# Altium schematic sheet LIDO-HW.300.StatusLightInterface.SchDoc
size A3; SheetNumber: 16; SheetTotal: 17
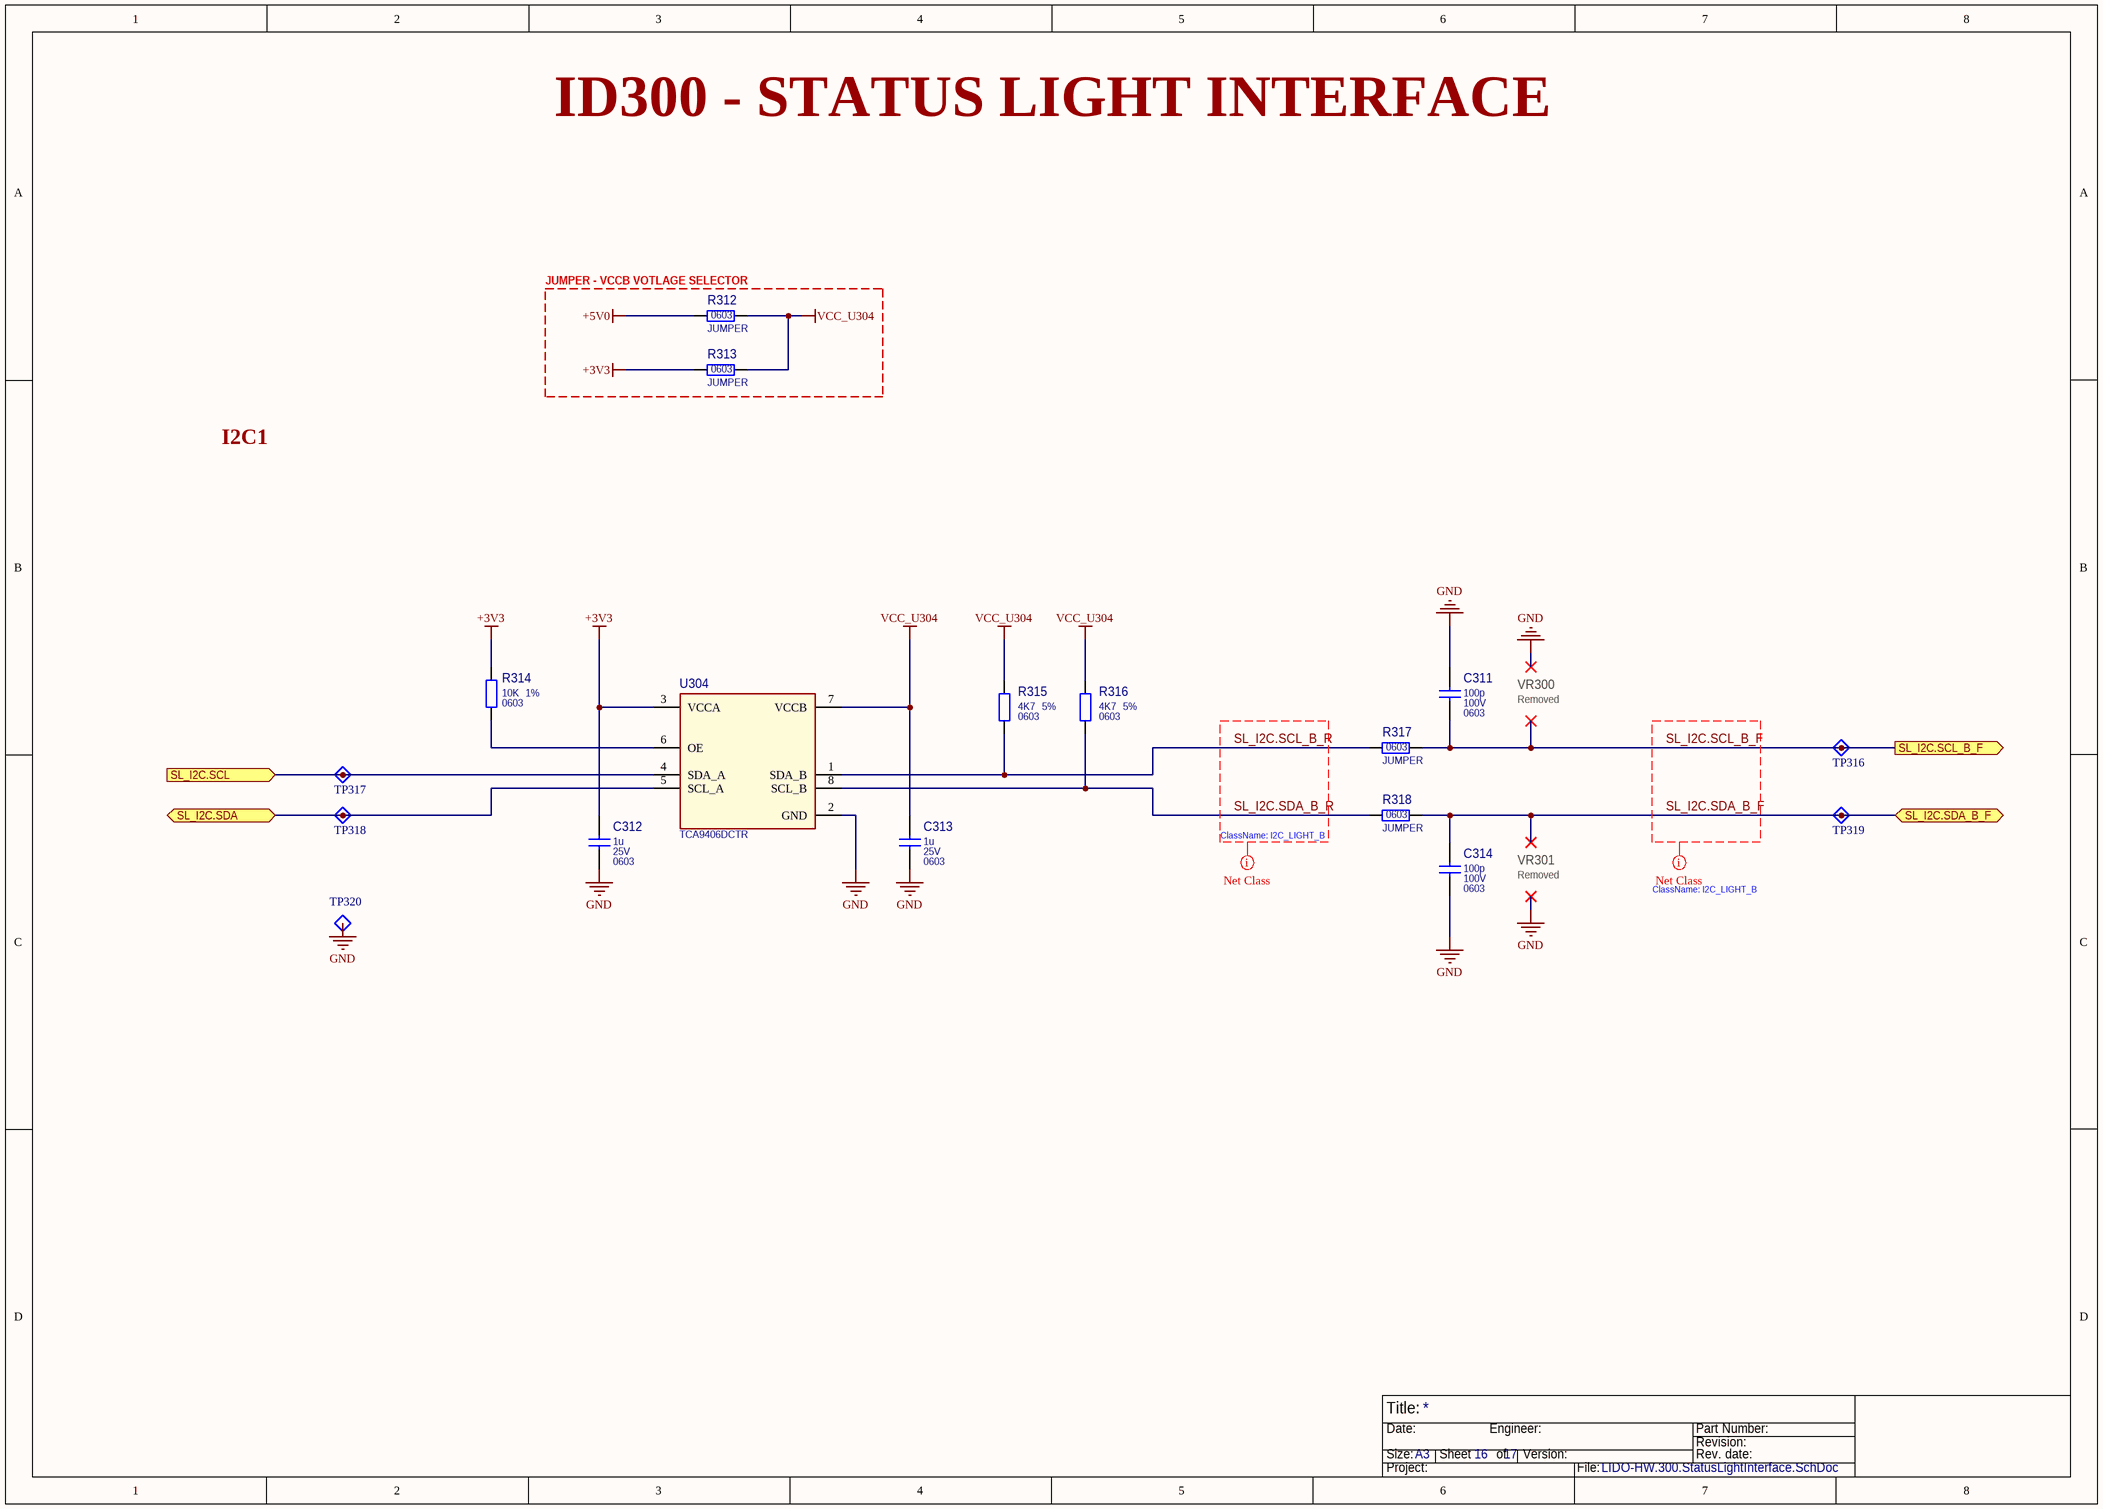
[diagram p0: LIDO-HW.300.StatusLightInterface.SchDoc]

## Parts
C311  100p  Part Value 2: 100V  Part Package: 0603  [CAP_0603_1608X90-N_MURATA_A]
C312  1u  Part Value 2: 25V  Part Package: 0603  [CAP_0603_1608X90-N_MURATA_A]
C313  1u  Part Value 2: 25V  Part Package: 0603  [CAP_0603_1608X90-N_MURATA_A]
C314  100p  Part Value 2: 100V  Part Package: 0603  [CAP_0603_1608X90-N_MURATA_A]
R312  JUMPER  Part Package: 0603  [RES_0603_1608X60-N_YAGEO_A]
R313  JUMPER  Part Package: 0603  [RES_0603_1608X60-N_YAGEO_A]
R314  10K  Part Value 2: 1%  Part Package: 0603  [RES_0603_1608X60-N_YAGEO_A]
R315  4K7  Part Value 2: 5%  Part Package: 0603  [RES_0603_1608X60-N_YAGEO_A]
R316  4K7  Part Value 2: 5%  Part Package: 0603  [RES_0603_1608X60-N_YAGEO_A]
R317  JUMPER  Part Package: 0603  [RES_0603_1608X60-N_YAGEO_A]
R318  JUMPER  Part Package: 0603  [RES_0603_1608X60-N_YAGEO_A]
TP316  TestPoint_A  [TESTPOINT_1D_A]  (value not drawn)  (no BOM)
TP317  TestPoint_A  [TESTPOINT_1D_A]  (value not drawn)  (no BOM)
TP318  TestPoint_A  [TESTPOINT_1D_A]  (value not drawn)  (no BOM)
TP319  TestPoint_A  [TESTPOINT_1D_A]  (value not drawn)  (no BOM)
TP320  TestPoint_A  [TESTPOINT_1D_A]  (value not drawn)  (no BOM)
U304  TCA9406DCTR  [SSOP8P65_295X400X130L40X25-N_TI_A]

## Blocks framed on the sheet
JUMPER - VCCB VOTLAGE SELECTOR: R312 R313

## Ports
SL_I2C.SCL (in), SL_I2C.SCL_B_F (out), SL_I2C.SDA (bidir), SL_I2C.SDA_B_F (bidir)

## Nets
+3V3: C312.1 R313.1 R314.2 U304.3(VCCA)
+5V0: R312.1
GND: C311.1 C312.2 C313.2 C314.2 TP320.1(TP) U304.2(GND)
VCC_U304: C313.1 R312.2 R313.2 R315.2 R316.2 U304.7(VCCB)
SL_I2C.SCL: TP317.1(TP) U304.4(SDA_A) ; port SL_I2C.SCL
SL_I2C.SCL_B_F: C311.2 R317.2 TP316.1(TP) ; port SL_I2C.SCL_B_F
SL_I2C.SCL_B_R: R315.1 R317.1 U304.1(SDA_B)
SL_I2C.SDA: TP318.1(TP) U304.5(SCL_A) ; port SL_I2C.SDA
SL_I2C.SDA_B_F: C314.1 R318.2 TP319.1(TP) ; port SL_I2C.SDA_B_F
SL_I2C.SDA_B_R: R316.1 R318.1 U304.8(SCL_B)
NetR314_1: R314.1 U304.6(OE)

## Layout directives
net class I2C1_LIGHT_B: SL_I2C.SCL_B_F, SL_I2C.SCL_B_R, SL_I2C.SDA_B_F, SL_I2C.SDA_B_R

## Notes on the sheet
- ID300 - STATUS LIGHT INTERFACE
- I2C1
- Removed
- VR300
- ClassName: I2C_LIGHT_B
- VR301
- Title:
- Size:
- Date:
- A3
- Sheet       of
- Engineer:
- Version:
- Part Number:
- Revision:
- Rev. date:
- Project:
- File:

## Library data of the parts
C311 C314 = 75: CAP CER 100PF 100V C0G 0603; Manufacturer Part Number: CGA3E2C0G2A101J080AA; Manufacturer: TDK Corporation; Obsolete Part: False; Component ID: 75; Part Value: 100p; Part Value 3: 5%; Package Type: SMT
C312 C313 = 78: CAP CER 1UF 25V X7R 0603; Manufacturer Part Number: CGA3E1X7R1E105M080AE; Manufacturer: TDK Corporation; Obsolete Part: False; Component ID: 78; Part Value: 1u; Part Value 3: X7R; Package Type: SMT
R312 R313 R317 R318 = 9: RES 0 OHM JUMPER 1/10W 0603; Manufacturer Part Number: RC0603JR-070RL; Manufacturer: YAGEO; Manufacturer Part Number 2nd: RMCF0603ZT0R00; Manufacturer 2nd: Stackpole Electronics Inc; Obsolete Part: False; Component ID: 9; Part Value: JUMPER; Part Value 2: 5%; Part Value 3: 1/10W; Package Type: SMT
R314 = 115: RES 10K OHM 1% 1/10W 0603; Manufacturer Part Number: RC0603FR-0710KL; Manufacturer: YAGEO; Obsolete Part: False; Component ID: 115; Part Value: 10K; Part Value 3: 1/10W; Package Type: SMT
R315 R316 = 119: RES 4.7K OHM 5% 1/10W 0603; Manufacturer Part Number: RC0603JR-074K7L; Manufacturer: YAGEO; Obsolete Part: False; Component ID: 119; Part Value: 4K7; Part Value 3: 1/10W; Package Type: SMT
TP316-TP320 = 3: Pad Diamater 1mm; Part: Test Point 1D A; Obsolete Part: False; 00_Name: TP_XXmm; Component ID: 3; 02_Layer: *; 01_Diameter: 1mm
U304 = 6: Voltage Level Translator Bidirectional 1 Circuit 2 Channel 24Mbps SM8; Manufacturer: Texas Instruments; Part Package: MSOP-8; Obsolete Part: False; Component ID: 6; Manufacturer Part Number: TCA9406DCTR; Part Type: Level Translator; Part Value: TCA9406DCTR; Package Type: SMT